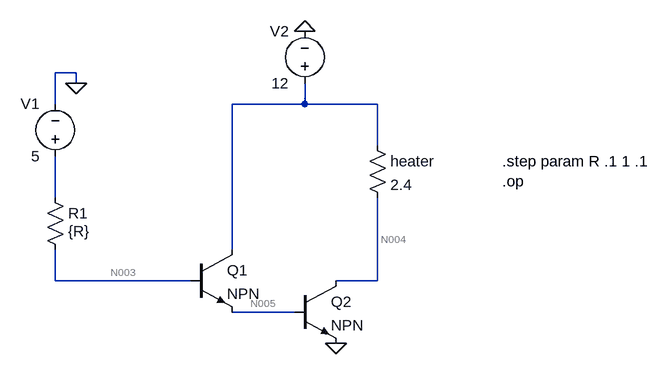
[diagram p0: schematic a1-2f.asc]
a1-2f.asc, the LTspice schematic file:
Version 4
SHEET 1 1380 680
WIRE 176 -304 144 -304
WIRE 176 -288 176 -304
WIRE 144 -256 144 -304
WIRE 528 -256 528 -288
WIRE 528 -256 416 -256
WIRE 640 -256 528 -256
WIRE 640 -192 640 -256
WIRE 144 -112 144 -176
WIRE 416 -32 416 -256
WIRE 144 16 144 -32
WIRE 352 16 144 16
WIRE 640 16 640 -112
WIRE 640 16 576 16
WIRE 512 64 416 64
FLAG 176 -288 0
FLAG 528 -368 0
FLAG 576 112 0
SYMBOL voltage 144 -160 R180
WINDOW 0 24 96 Left 2
WINDOW 3 24 16 Left 2
WINDOW 123 0 0 Left 0
WINDOW 39 0 0 Left 0
SYMATTR InstName V1
SYMATTR Value 5
SYMBOL res 128 -128 R0
WINDOW 3 36 68 Left 2
SYMATTR InstName R1
SYMATTR Value {R}
SYMBOL npn 352 -32 R0
SYMATTR InstName Q1
SYMBOL voltage 528 -272 R180
WINDOW 0 24 96 Left 2
WINDOW 3 24 16 Left 2
SYMATTR InstName V2
SYMATTR Value 12
SYMBOL res 624 -208 R0
SYMATTR InstName heater
SYMATTR Value 2.4
SYMBOL npn 512 16 R0
SYMATTR InstName Q2
TEXT 832 -168 Left 2 !.step param R .1 1 .1\n.op

The netlist it stands for:
* a1-2f.asc
V1 N002 0 5
R1 N002 N003 {R}
Q1 N001 N003 N005 0 NPN
V2 N001 0 12
R§heater N001 N004 2.4
Q2 N004 N005 0 0 NPN
.model NPN NPN
.model PNP PNP
.lib standard.bjt
.step param R .1 1 .1
.op
.backanno
.end

* Results of the author's LTspice run, read from the files saved beside the schematic
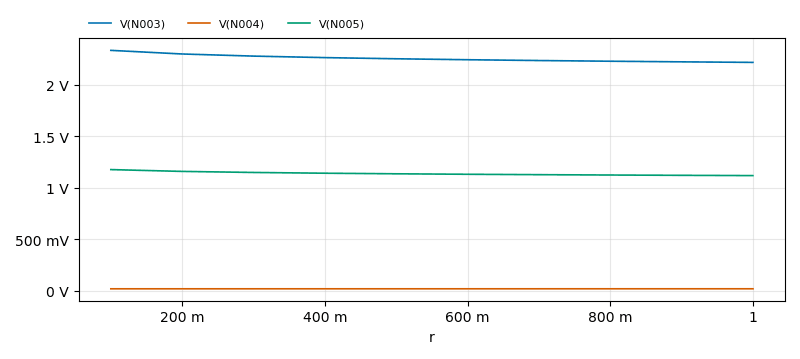
[diagram p1: Operating Point of a1-2f.asc, plotted from the saved traces]
* Operating Point, 1 run:
*   V(N003): 2.332 V at r=100 m, 2.215 V at r=1 , min 2.215 V, max 2.332 V
*   V(N004): 17.95 mV at r=100 m, 18.16 mV at r=1 , min 17.95 mV, max 18.16 mV
*   V(N005): 1.175 V at r=100 m, 1.116 V at r=1 , min 1.116 V, max 1.175 V
* From the log:
*   Semiconductor Device Operating Points:
*                           --- Bipolar Transistors ---
*   Name:       q2          q1
*   Model:      npn         npn
*   Ib:       2.70e+03    2.67e+01
*   Ic:       4.99e+00    2.67e+03
*   Vbe:      1.17e+00    1.16e+00
*   Vbc:      1.16e+00   -9.67e+00
*   Vce:      1.80e-02    1.08e+01
*   BetaDC:   1.85e-03    1.00e+02
*   Gm:       1.02e+05    1.03e+05
*   Rpi:      4.89e-04    9.69e-04
*   Rx:       0.00e+00    0.00e+00
*   Ro:       9.79e-06    0.00e+00
*   Cbe:      0.00e+00    0.00e+00
*   Cbc:      0.00e+00    0.00e+00
*   Cjs:      0.00e+00    0.00e+00
*   BetaAC:   5.00e+01    1.00e+02
*   Cbx:      0.00e+00    0.00e+00
*   Ft:       0.00e+00    0.00e+00